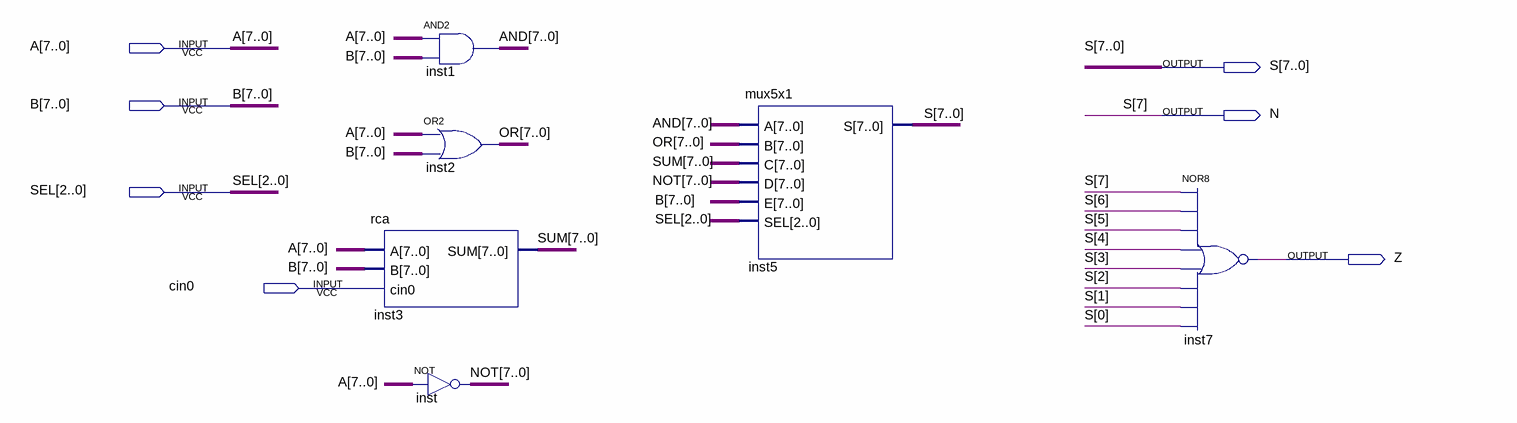
[diagram p0: schematic sheet]
// Quartus schematic ulaneander.bdf as structural Verilog: 6 symbols, 7 pins
module ulaneander (
  input  [7:0] A,
  input  [7:0] B,
  input  [2:0] SEL,
  input  cin0,
  output [7:0] S,
  output N,
  output Z
);

  wire [7:0] AND, NOT, OR, SUM;

  assign AND = A & B;  // AND2 inst1, 8 bits wide
  assign OR = A | B;  // OR2 inst2, 8 bits wide
  rca inst3 (.A(A), .B(B), .cin0(cin0), .SUM(SUM));
  assign NOT = ~A;  // NOT inst, 8 bits wide
  mux5x1 inst5 (.A(AND), .B(OR), .C(SUM), .D(NOT), .E(B), .SEL(SEL), .S({N, S[6:0]}));
  nor inst7 (Z, N, S[6], S[5], S[4], S[3], S[2], S[1], S[0]);

  assign S[7] = N;
endmodule
